# EAGLE design Kapazitätsmessung (EAGLE 4.15)
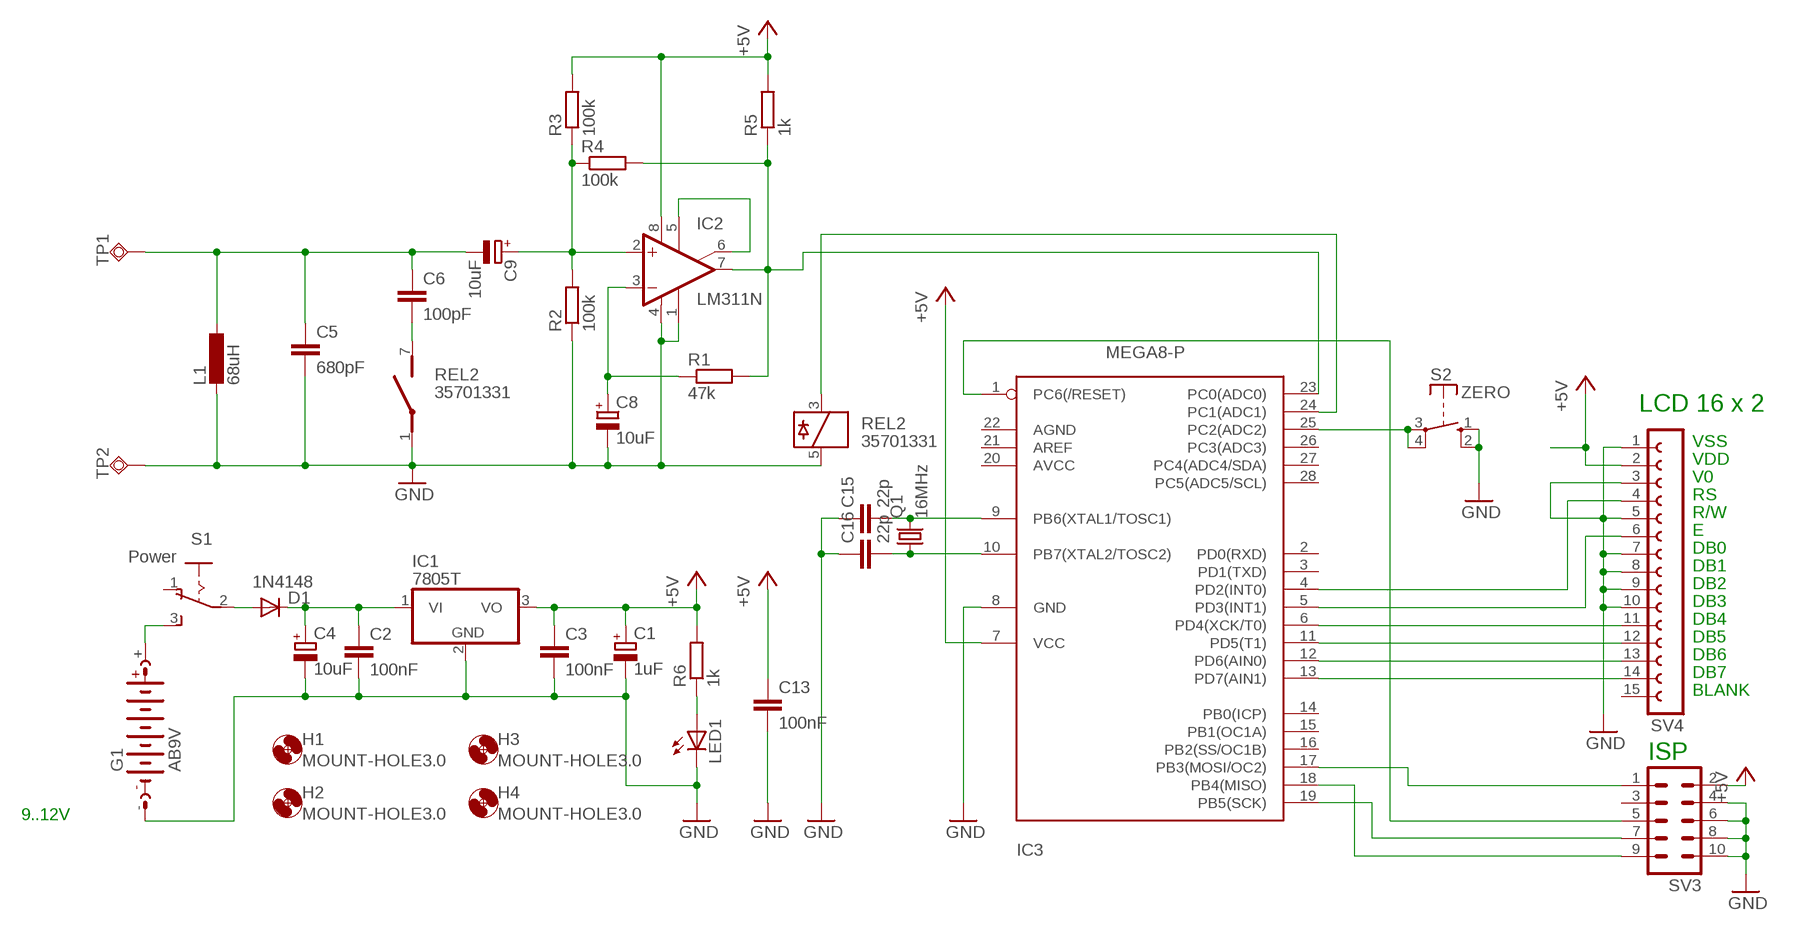
[diagram p0: schematic, sheet 1]

## Parts
C1  1uF  CPOL-EUE2.5-7  [E2,5-7]
C2  100nF  C-EU025-030X050  [C025-030X050]
C3  100nF  C-EU025-030X050  [C025-030X050]
C4  10uF  CPOL-EUE2.5-7  [E2,5-7]
C5  680pF  C-EU025-030X050  [C025-030X050]
C6  100pF  C-EU025-030X050  [C025-030X050]
C8  10uF  CPOL-EUE2.5-5  [E2,5-5]
C9  10uF  CPOL-EUE2.5-5  [E2,5-5]
C13  100nF  C-EU025-030X050  [C025-030X050]
C15  22p  C-EU025-024X044  [C025-024X044]
C16  22p  C-EU025-024X044  [C025-024X044]
D1  1N4148  [DO35-10]
G1  AB9V  [AB9V]
H1  MOUNT-HOLE3.0  [3,0]
H2  MOUNT-HOLE3.0  [3,0]
H3  MOUNT-HOLE3.0  [3,0]
H4  MOUNT-HOLE3.0  [3,0]
IC1  7805T  [TO220H]
IC2  LM311N  [DIL08]
IC3  MEGA8-P  [DIL28-3]
L1  68uH  L-EU0207/10  [0207/10]
LED1  LED3MM  [LED3MM]
Q1  16MHz  CRYTALHC49S  [HC49/S]
R1  47k  R-EU_0207/7  [0207/7]
R2  100k  R-EU_0207/7  [0207/7]
R3  100k  R-EU_0207/7  [0207/7]
R4  100k  R-EU_0207/7  [0207/7]
R5  1k  R-EU_0207/7  [0207/7]
R6  1k  R-EU_0207/7  [0207/7]
REL2  35701331  [REED]
S1  Power  255SB  [255SB]
S2  ZERO  DT6  [DT6]
SV3  ML10  [ML10]
SV4  FE15-1  [FE15]
TP1  TPSQPAD1-20Y  [P1-20Y]
TP2  TPSQPAD1-20Y  [P1-20Y]

## Nets
+5V: C1.+ C3.1 C13.1 IC1.3(VO) IC2.8(V+) IC3.7(VCC) R3.2 R5.2 R6.2 SV3.2 SV4.2
GND: C1.- C2.2 C3.2 C4.- C5.2 C8.- C13.2 C15.1 C16.1 G1.- IC1.2(GND) IC2.1(GND) IC2.4(V-) IC3.8(GND) L1.2 LED1.K(C) R2.1 REL2.1(2:P) REL2.5 S2.1(S) S2.2(S) SV3.4 SV3.6 SV3.8 SV3.10 SV4.1 SV4.3 SV4.5 SV4.7 SV4.8 SV4.9 SV4.10 TP2.1(TP)
N$1: D1.A S1.2(P)
N$2: C2.1 C4.+ D1.C IC1.1(VI)
N$3: G1.+ S1.3(S)
N$4: IC3.1(PC6(/RESET)) SV3.5
N$5: IC2.5(ON) IC2.6(ON/STR)
N$6: IC2.7(OUT) IC3.23(PC0(ADC0)) R1.2 R4.2 R5.1
N$8: C8.+ IC2.3(-IN) R1.1
N$9: C6.2 REL2.7(2:S)
N$10: C9.+ IC2.2(+IN) R2.2 R3.1 R4.1
N$11: C5.1 C6.1 C9.- L1.1 TP1.1(TP)
N$13: LED1.A R6.1
N$14: IC3.19(PB5(SCK)) SV3.7
N$15: IC3.18(PB4(MISO)) SV3.9
N$22: C15.2 IC3.9(PB6(XTAL1/TOSC1)) Q1.2
N$23: C16.2 IC3.10(PB7(XTAL2/TOSC2)) Q1.1
N$25: IC3.4(PD2(INT0)) SV4.4
N$26: IC3.5(PD3(INT1)) SV4.6
N$27: IC3.13(PD7(AIN1)) SV4.14
N$28: IC3.12(PD6(AIN0)) SV4.13
N$29: IC3.11(PD5(T1)) SV4.12
N$30: IC3.6(PD4(XCK/T0)) SV4.11
N$31: IC3.17(PB3(MOSI/OC2)) SV3.1
N$34: IC3.24(PC1(ADC1)) REL2.3
N$35: IC3.25(PC2(ADC2)) S2.3(P) S2.4(P)
Unconnected: IC3.2(PD0(RXD)) IC3.3(PD1(TXD)) IC3.14(PB0(ICP)) IC3.15(PB1(OC1A)) IC3.16(PB2(SS/OC1B)) IC3.20(AVCC) IC3.21(AREF) IC3.22(AGND) IC3.26(PC3(ADC3)) IC3.27(PC4(ADC4/SDA)) IC3.28(PC5(ADC5/SCL)) S1.1(O) SV3.3 SV4.15

## Notes on the sheet
- LCD 16 x 2
- VSS
- VDD
- V0
- RS
- R/W
- E
- DB0
- DB1
- DB2
- DB3
- DB4
- DB5
- DB6
- DB7
- BLANK
- ISP
- 9..12V

## Library data of the parts
C1 C4 C8 C9 = rcl:CPOL-EU: POLARIZED CAPACITOR, European symbol
C2 C3 C5 C6 C13 C15 C16 = rcl:C-EU: CAPACITOR, European symbol
D1 = diode:1N4148: DIODE high speed (Philips)
G1 = battery:AB9V: 9-V BATTERY CLIP
H1-H4 = holes:MOUNT-HOLE: MOUNTING HOLE with drill center marker
IC1 = linear:78*: Positive VOLTAGE REGULATOR Source: http://cache.national.com/ds/LM/LM78L05.pdf http://www.fairchildsemi.com/ds/LM/LM7805.pdf
IC2 = linear:LM311: COMPARATOR
IC3 = atmel2:MEGA8-P: MICROCONTROLLER 8 Kbytes FLASH 1 kbytes SRAM 512 bytes EEPROM USART 4-channel 10 bit ADC 2-channel 8 bit ADC
L1 = rcl:L-EU: INDUCTOR, European symbol
LED1 = led:LED: LED OSRAM: - CHIPLED LG R971, LG N971, LY N971, LG Q971, LY Q971, LO R971, LY R971 LH N974, LH R974 LS Q976, LO Q976, LY Q976 LO Q996 - Hyper CHIPLED LW Q18S LB Q993, LB Q99A, LB R99A - SideLED LS A670, LO A670, LY A670, LG A670, LP A670 LB A673, LV A673, LT A673, LW A673 LH A674 LY A675 LS A676, LA A676, LO A676, LY A676, LW A676 LS A679, LY A679, LG A679 - Hyper Micro SIDELED® LS Y876, LA Y876, LO Y876, LY Y876 LT Y87S - SmartLED LW L88C, LW L88S LB L89C, LB L89S, LG L890 LS L89K, LO L89K, LY L89K LS L896, LA L896, LO L896, LY L896 - TOPLED LS T670, LO T670, LY T670, LG T670, LP T670 LSG T670, LSP T670, LSY T670, LOP T670, LYG T670 LG T671, LOG T671, LSG T671 LB T673, LV T673, LT T673, LW T673 LH T674 LS T676, LA T676, LO T676, LY T676, LB T676, LH T676, LSB T676, LW T676 LB T67C, LV T67C, LT T67C, LS T67K, LO T67K, LY T67K, LW E67C LS E67B, LA E67B, LO E67B, LY E67B, LB E67C, LV E67C, LT E67C LW T67C LS T679, LY T679, LG T679 LS T770, LO T770, LY T770, LG T770, LP T770 LB T773, LV T773, LT T773, LW T773 LH T774 LS E675, LA E675, LY E675, LS T675 LS T776, LA T776, LO T776, LY T776, LB T776 LHGB T686 LT T68C, LB T68C - Hyper Mini TOPLED® LB M676 - Mini TOPLED Santana® LG M470 LS M47K, LO M47K, LY M47K Source: http://www.osram.convergy.de/
Q1 = crystal:CRYTAL: CRYSTAL
R1-R6 = rcl:R-EU_: RESISTOR, European symbol
REL2 = relay:35701331: RELAY reed, 1 x norm. open with polarity
S1 = switch:255SB: SLIDING SWITCH distributor Buerklin, 11G810
S2 = switch-misc:DT: ITT SWITCH
SV3 = con-harting-ml:ML10: HARTING
SV4 = con-lsta:FE15-1: FEMALE HEADER
TP1 TP2 = testpad:TPSQ

## Board
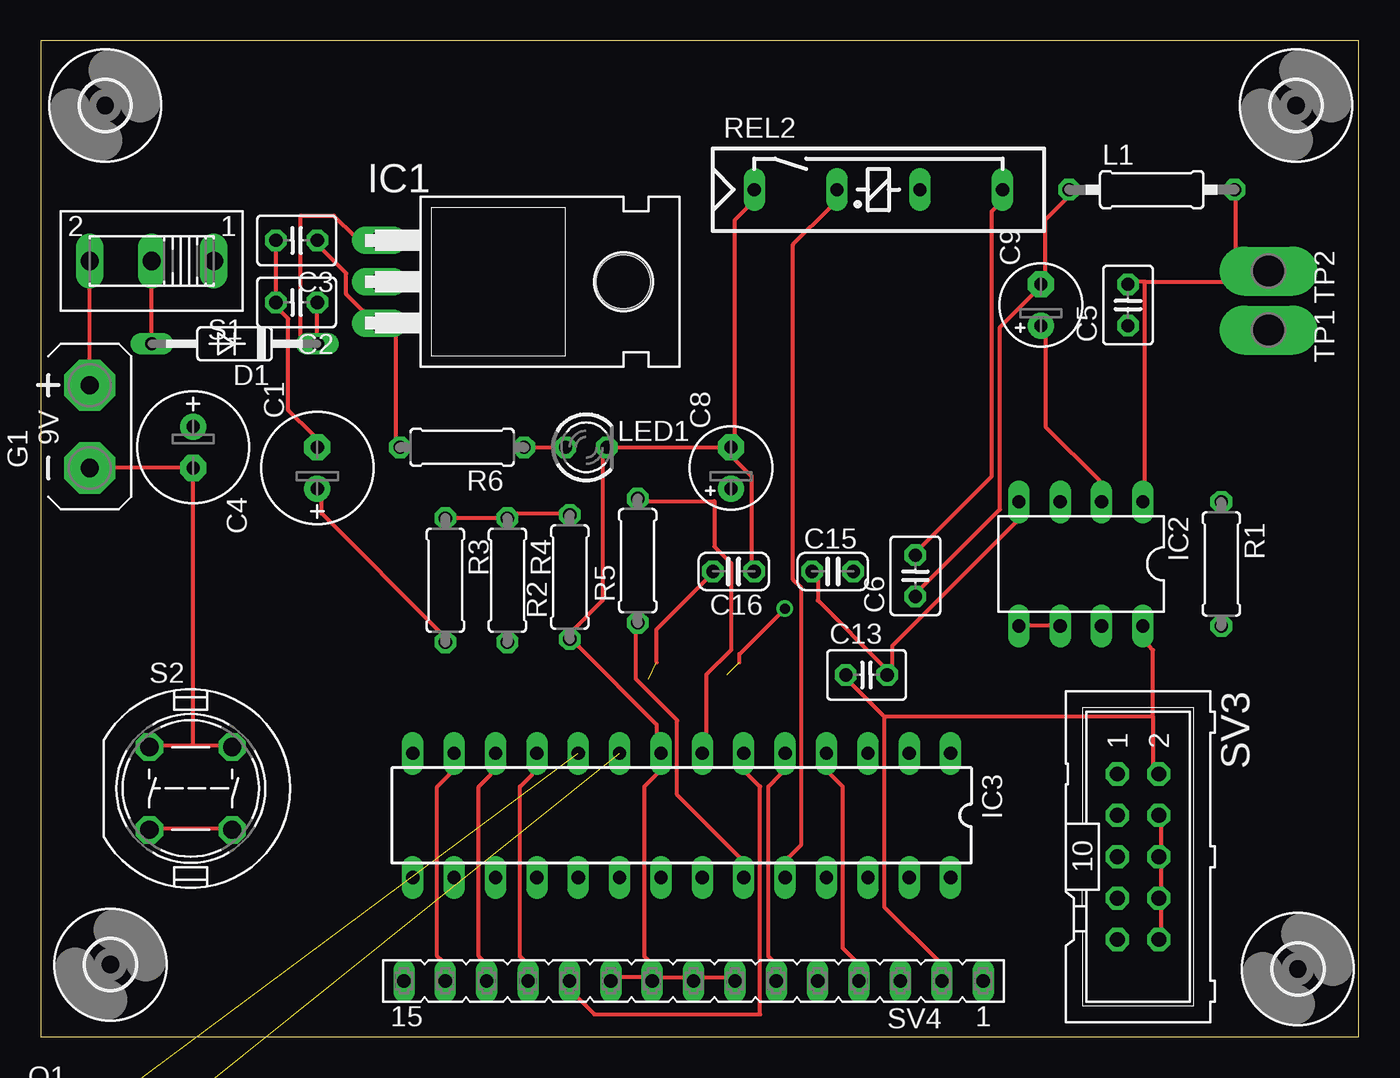
[diagram p1: board, top side]
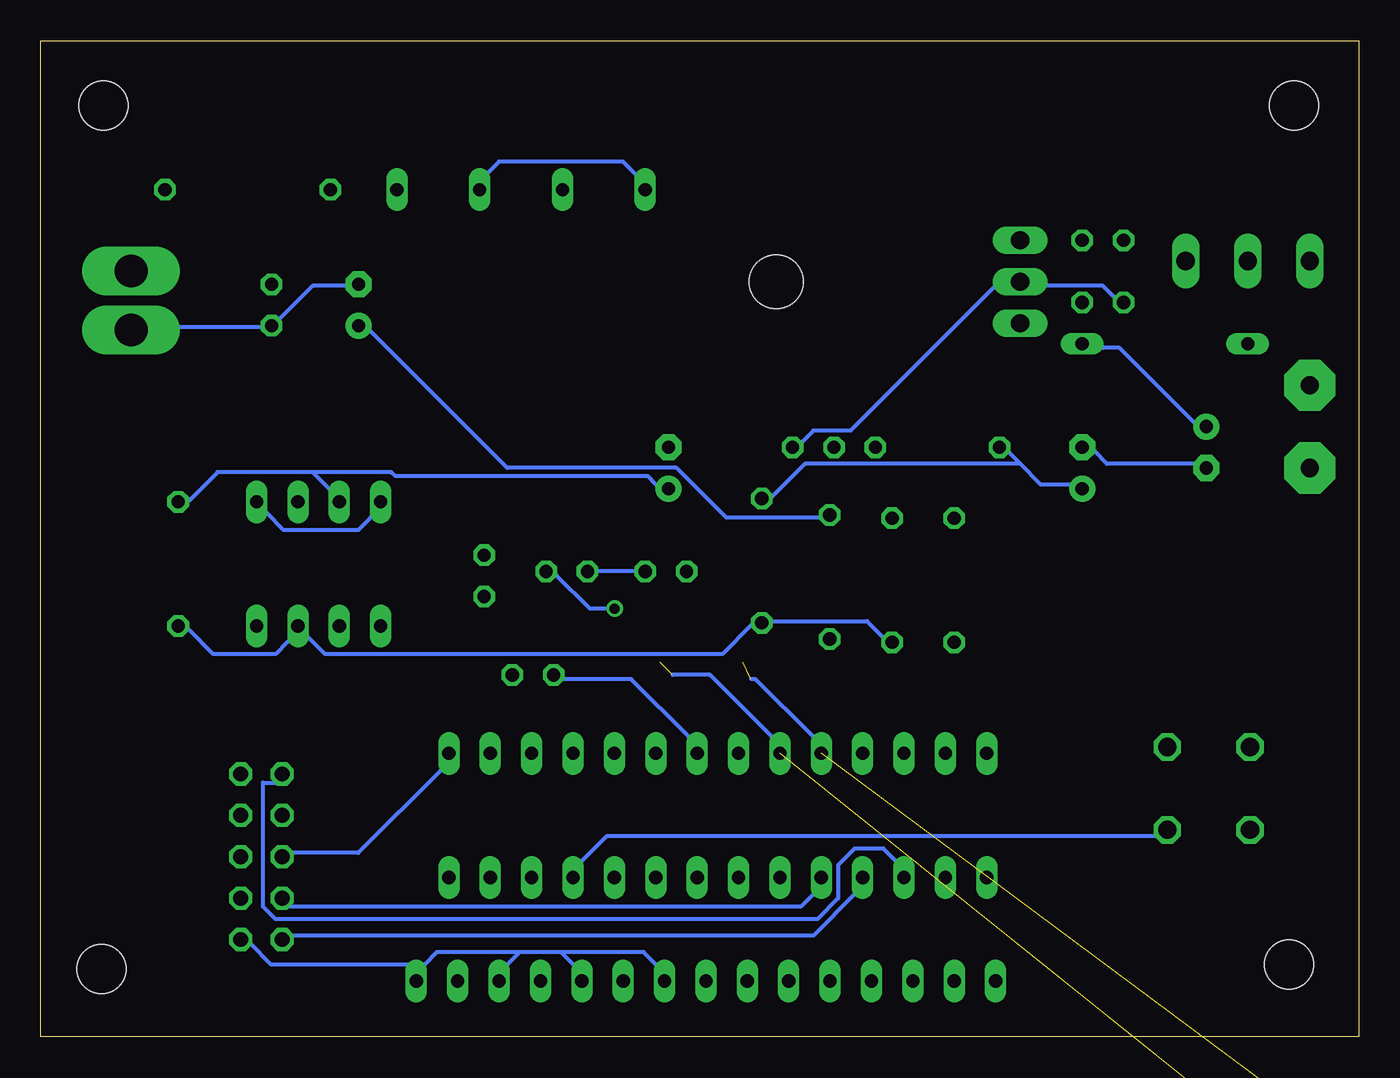
[diagram p2: board, bottom side, seen from below]

Size 80.92 x 61.14 mm. Coordinates in mm from the lower left corner, seen from the top.
Outline: 0,0 80.92,0 80.92,61.14 0,61.14 0,0
Copper layers (1*16): Top 0.035mm / dielectric 1.5mm / Bottom 0.035mm
Design rules "default": minimum track width 10mil, minimum drill 24mil, track to track 8mil, track to pad 8mil, pad to pad 8mil, via to via 8mil, smd to smd 8mil, copper to edge 40mil, drill to drill 8mil, minimum pad ring 10mil, minimum via ring 8mil, stop-mask expansion 4mil, vias tented up to drill 0mil, thermal gap 10mil

### Footprints (pad centres in the part's own frame; a part is rotated, then mirrored left to right if it is on the bottom)
E2,5-7 = drill 0.813 pad 1.6 round: + -1.27,0 | drill 0.813 pad 1.6 octagon: - 1.27,0
C025-030X050 = drill 0.813 octagon: 1 -1.27,0; 2 1.27,0
E2,5-5 = drill 0.813 pad 1.6 round: + -1.27,0 | drill 0.813 pad 1.6 octagon: - 1.27,0
C025-024X044 = drill 0.813 octagon: 1 -1.27,0; 2 1.27,0
DO35-10 = drill 0.813 long: A 5.08,0; C -5.08,0
AB9V = drill 1.118 pad 3.15 octagon: + 0,2.54; - 0,-2.54
3,0 = hole 3: 0,0
TO220H = drill 1.118 long: 1 -2.54,-10.16; 2 0,-10.16; 3 2.54,-10.16 | hole 3.302: 0,4.826
DIL08 = drill 0.813 long: 1 -3.81,-3.81; 2 -1.27,-3.81; 3 1.27,-3.81; 4 3.81,-3.81; 5 3.81,3.81; 6 1.27,3.81; 7 -1.27,3.81; 8 -3.81,3.81
DIL28-3 = drill 0.813 long: 1 -16.51,-3.81; 2 -13.97,-3.81; 3 -11.43,-3.81; 4 -8.89,-3.81; 5 -6.35,-3.81; 6 -3.81,-3.81; 7 -1.27,-3.81; 8 1.27,-3.81; 9 3.81,-3.81; 10 6.35,-3.81; 11 8.89,-3.81; 12 11.43,-3.81; 13 13.97,-3.81; 14 16.51,-3.81; 15 16.51,3.81; 16 13.97,3.81; 17 11.43,3.81; 18 8.89,3.81; 19 6.35,3.81; 20 3.81,3.81; 21 1.27,3.81; 22 -1.27,3.81; 23 -3.81,3.81; 24 -6.35,3.81; 25 -8.89,3.81; 26 -11.43,3.81; 27 -13.97,3.81; 28 -16.51,3.81
0207/10 = drill 0.813 octagon: 1 -5.08,0; 2 5.08,0
LED3MM = drill 0.813 octagon: A -1.27,0; K 1.27,0
HC49/S = drill 0.813 round: 1 -2.413,0; 2 2.413,0
0207/7 = drill 0.813 octagon: 1 -3.81,0; 2 3.81,0
REED = drill 0.813 long: 1 -17.78,2.54; 3 -12.7,2.54; 5 -7.62,2.54; 7 -2.54,2.54
255SB = drill 1.118 long: 1 -3.81,0; 2 0,0; 3 3.81,0
DT6 = drill 1.118 octagon: 1 -2.54,2.54; 2 2.54,2.54; 3 2.54,-2.54; 4 -2.54,-2.54
ML10 = drill 0.914 octagon: 1 -5.08,-1.27; 2 -5.08,1.27; 3 -2.54,-1.27; 4 -2.54,1.27; 5 0,-1.27; 6 0,1.27; 7 2.54,-1.27; 8 2.54,1.27; 9 5.08,-1.27; 10 5.08,1.27
FE15 = drill 0.813 long: 1 -17.78,0; 2 -15.24,0; 3 -12.7,0; 4 -10.16,0; 5 -7.62,0; 6 -5.08,0; 7 -2.54,0; 8 0,0; 9 2.54,0; 10 5.08,0; 11 7.62,0; 12 10.16,0; 13 12.7,0; 14 15.24,0; 15 17.78,0
P1-20Y = drill 2.007 pad 2.54 long: 1 0,0

### Placement (x,y rotation side)
C1  16.98,34.92 90 top
C2  15.71,45.08 180 top
C3  15.71,48.89 180 top
C4  9.36,36.19 270 top
C5  66.75,44.92 90 top
C6  53.7,28.3 90 top
C8  42.38,34.92 90 top
C9  61.4,44.92 90 top
C13  50.7,22.22 0 top
C15  48.62,28.57 0 top
C16  42.54,28.57 180 top
D1  11.9,42.54 180 top
G1  3.01,37.46 0 top
H1  4.28,4.44 0 top
H2  3.96,57.17 0 top
H3  77.07,57.17 0 top
H4  77.18,4.17 0 top
IC1  30.95,46.35 270 top
IC2  63.86,29.03 180 top
IC3  39.35,13.6 180 top
L1  68.21,52 0 top
LED1  33.49,36.19 0 top
Q1  4.28,-5.72 0 top  (outside the outline)
R1  72.48,29.03 270 top
R2  32.48,28.23 90 top
R3  24.84,28.03 270 top
R4  28.65,28.03 270 top
R5  36.65,29.23 90 top
R6  25.87,36.19 180 top
REL2  61.59,49.46 0 top
S1  6.82,47.62 180 top
S2  9.21,15.25 0 top
SV3  67.37,11.06 270 top
SV4  40.08,3.44 180 top
TP1  75.37,43.38 270 top
TP2  75.37,47 270 top

### Tracks (layer width: path | path; a pad name or v marks a point on that pad's centre or on a via)
+5V
  Top 0.254: C3.1 17.23,48.38 18.76,46.86 18.76,45.59 19.77,44.57 IC1.3 21.81,43.05 21.81,36.7 R6.2 | R3.2 24.6,24.76 17.23,32.13 17.23,32.89 C1.+ | 68.29,19.68 68.29,16.63 SV3.2 | 68.29,19.68 68.29,23.74 68.03,24 IC2.8 | 51.78,19.68 51.78,8 55.08,4.69 SV4.2 | 51.78,19.68 49.75,21.71 C13.1 | 51.78,19.68 68.29,19.68 | R5.2 37.3,32.89 41.36,32.89 41.36,30.09 42.38,29.08 42.38,23.74 40.86,22.22 40.86,18.66 IC3.7
  Bottom 0.254: 20.79,35.17 19.52,33.9 17.74,33.9 C1.+ | 20.79,35.17 21.55,35.94 R6.2 | 20.79,35.17 34,35.17 36.03,33.14 R5.2 | IC3.7 41.11,18.41 44.67,21.97 48.98,21.97 C13.1
GND
  Top 0.254: C3.2 C2.2 14.69,44.57 15.2,44.06 15.2,38.48 16.73,36.95 C1.- | 9.36,17.9 11.14,17.9 S2.2 | 9.36,17.9 7.33,17.9 S2.1 | G1.- C4.- 9.36,17.9 | SV3.10 68.8,6.47 68.8,8 SV3.8 68.8,9.01 68.8,10.54 SV3.6 68.8,11.55 68.8,13.08 SV3.4 | SV4.10 35.52,3.68 37.05,3.68 SV4.9 | SV4.7 42.13,3.68 40.6,3.68 SV4.8 39.59,3.68 38.06,3.68 SV4.9 | 67.78,46.35 72.61,46.35 TP2.1 73.37,48.38 73.37,51.43 L1.2 | 67.78,46.35 67.27,46.35 C5.2 | 67.78,46.35 67.78,34.16 IC2.1 | C8.- LED1.K 34.51,35.68 34.51,26.79 32.73,25.01 R2.1 32.98,24 37.81,19.17 37.81,18.66 IC3.8 37.81,16.12 37.05,15.36 37.05,4.95 37.3,4.69 SV4.9 | C15.1 47.71,28.06 47.71,26.79 51.78,22.73 C13.2 52.29,22.73 52.29,24 59.91,31.62 IC2.4 | C8.- 42.63,35.43 43.65,34.41 43.65,29.08 C16.1 | REL2.1 43.4,50.92 42.63,50.16 42.63,36.95 C8.-
  Bottom 0.254: C2.2 14.95,45.33 15.71,46.1 19.27,46.1 IC1.2 22.31,46.1 31.2,37.21 33.49,37.21 34.25,36.44 LED1.K | C1.- 16.22,35.94 15.46,35.17 10.12,35.17 C4.- | 48.98,5.2 48.22,4.44 SV4.5 | 48.98,5.2 51.52,5.2 | 51.52,5.2 52.29,4.44 SV4.3 | 51.52,5.2 56.6,5.2 57.37,4.44 SV4.1 58.38,4.44 66.76,4.44 68.03,5.71 SV3.10 | 48.98,5.2 43.9,5.2 43.14,4.44 SV4.7 | IC2.4 60.67,31.87 61.43,31.11 66,31.11 67.02,32.13 IC2.1 | REL2.1 44.41,52.95 45.17,53.72 52.79,53.72 53.56,52.95 REL2.5 | C16.1 C15.1
N$1
  Top 0.254: D1.A S1.2
N$2
  Top 0.254: C2.1 D1.C 15.96,43.05 15.96,50.41 18,50.41 19.27,49.14 IC1.1
  Bottom 0.254: C4.+ 10.12,37.71 14.69,42.29 15.71,42.29 D1.C
N$3
  Top 0.254: G1.+ S1.3
N$4
  Bottom 0.254: IC3.1 56.35,16.38 61.43,11.3 65.49,11.3 SV3.5
N$5
  Top 0.254: IC2.5 60.67,25.27 61.94,25.27 IC2.6
N$6
  Top 0.254: IC3.23 42.89,11.04 39.08,14.85 39.08,19.43 36.54,21.97 36.54,24.76 R5.1
  Bottom 0.254: R1.2 71.84,25.01 70.32,23.49 66.51,23.49 65.75,24.25 IC2.7 64.48,24.51 63.46,23.49 39.08,23.49 37.3,25.27 R5.1 36.03,25.52 30.19,25.52 29.17,24.51 R4.2
N$8
  Bottom 0.254: 64.22,34.67 63.21,33.65 IC2.3 | 64.22,34.67 70.07,34.67 71.84,32.89 R1.1 | 64.22,34.67 59.4,34.67 59.14,34.41 43.65,34.41 43.14,33.9 C8.+
N$9
  Top 0.254: C6.2 54.06,30.09 58.38,34.41 58.38,50.67 58.64,50.92 REL2.7
N$10
  Top 0.254: R3.1 25.36,31.87 28.16,31.87 R4.1 29.17,32.13 31.97,32.13 R2.2 | IC2.2 64.99,34.16 61.68,37.46 61.68,43.05 C9.+
  Bottom 0.254: R2.2 32.98,31.87 38.82,31.87 41.87,34.92 52.29,34.92 60.67,43.3 C9.+
N$11
  Top 0.254: C6.1 54.06,27.55 58.89,32.38 58.89,43.56 60.92,45.59 C9.- 61.68,46.86 61.68,50.16 62.95,51.43 L1.1
  Bottom 0.254: C9.- 62.19,46.1 64.22,46.1 66.26,44.06 C5.1 67.27,43.56 72.61,43.56 TP1.1
N$13
  Top 0.254: R6.1 LED1.A
N$14
  Bottom 0.254: IC3.19 33.49,8.76 34.25,8 65.75,8 SV3.7
N$15
  Bottom 0.254: IC3.18 30.95,8.76 33.49,6.22 65.49,6.22 SV3.9
N$22  (via drill 0.61)  (2 unrouted)
  Top 0.254: v45.68,26.28 42.89,23.49 42.89,22.98
  Bottom 0.254: 42.13,22.22 39.84,22.22 36.03,18.41 IC3.9 | v45.68,26.28 47.21,26.28 49.24,28.32 C15.2
N$23  (2 unrouted)
  Top 0.254: 37.81,22.98 37.81,25.01 40.86,28.06 C16.2
  Bottom 0.254: 37.3,21.97 37.05,21.97 33.49,18.41 IC3.10
N$25
  Top 0.254: SV4.4 50,4.69 49.24,5.46 49.24,15.36 48.48,16.12 IC3.4
N$26
  Top 0.254: SV4.6 44.92,4.69 44.67,4.95 44.67,15.36 45.43,16.12 IC3.5
N$27
  Top 0.254: SV4.14 24.6,4.69 24.35,4.95 24.35,15.36 25.11,16.12 IC3.13
N$28
  Top 0.254: SV4.13 27.14,4.69 26.89,4.95 26.89,15.36 27.65,16.12 IC3.12
N$29
  Top 0.254: SV4.12 29.68,4.69 29.43,4.95 29.43,15.36 30.19,16.12 IC3.11
N$30
  Top 0.254: SV4.11 32.98,2.41 34,1.39 44.16,1.39 44.16,15.36 43.4,16.12 IC3.6
N$31
  Bottom 0.254: IC3.17 28.41,10.79 29.17,11.55 30.95,11.55 31.97,10.54 31.97,8.5 33.24,7.23 66.51,7.23 67.27,8 67.27,15.62 66.51,15.62 SV3.1
N$34
  Top 0.254: IC3.24 45.94,11.04 46.7,11.81 46.7,27.55 46.19,28.06 46.19,48.64 48.48,50.92 REL2.3
N$35
  Top 0.254: S2.4 7.33,12.82 11.14,12.82 S2.3
  Bottom 0.254: IC3.25 47.71,10.79 46.19,12.31 12.41,12.31 S2.3